# EAGLE design GridThumbs (EAGLE 9.1.1)
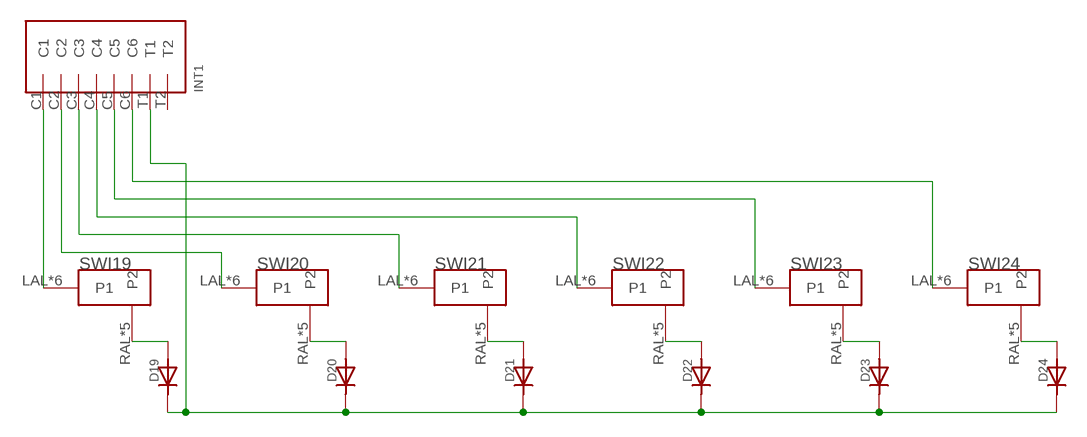
[diagram p0: schematic, sheet 1]

## Parts
D19  DIODE  [DIODE_COMBO]
D20  DIODE  [DIODE_COMBO]
D21  DIODE  [DIODE_COMBO]
D22  DIODE  [DIODE_COMBO]
D23  DIODE  [DIODE_COMBO]
D24  DIODE  [DIODE_COMBO]
INT1  INTRCNNT4X2  [INTRRIBBON]
SWI19  MX/ALPSDOUBLESIDED  [DOUBLED_MX/ALPS]
SWI20  MX/ALPSDOUBLESIDED  [DOUBLED_MX/ALPS]
SWI21  MX/ALPSDOUBLESIDED  [DOUBLED_MX/ALPS]
SWI22  MX/ALPSDOUBLESIDED  [DOUBLED_MX/ALPS]
SWI23  MX/ALPSDOUBLESIDED  [DOUBLED_MX/ALPS]
SWI24  MX/ALPSDOUBLESIDED  [DOUBLED_MX/ALPS]

## Nets
N$2: INT1.C2 SWI20.LAL(P1) SWI20.LAR(P1) SWI20.LCL(P1) SWI20.LCR(P1) SWI20.LLP(P1) SWI20.LRLP(P1)
N$3: INT1.C3 SWI21.LAL(P1) SWI21.LAR(P1) SWI21.LCL(P1) SWI21.LCR(P1) SWI21.LLP(P1) SWI21.LRLP(P1)
N$4: INT1.C4 SWI22.LAL(P1) SWI22.LAR(P1) SWI22.LCL(P1) SWI22.LCR(P1) SWI22.LLP(P1) SWI22.LRLP(P1)
N$5: INT1.C5 SWI23.LAL(P1) SWI23.LAR(P1) SWI23.LCL(P1) SWI23.LCR(P1) SWI23.LLP(P1) SWI23.LRLP(P1)
N$6: INT1.C6 SWI24.LAL(P1) SWI24.LAR(P1) SWI24.LCL(P1) SWI24.LCR(P1) SWI24.LLP(P1) SWI24.LRLP(P1)
N$7: D19.ANOSB(AN) D19.ANOST(AN) D19.ANOT(AN) SWI19.RAL(P2) SWI19.RAR(P2) SWI19.RCL(P2) SWI19.RCR(P2) SWI19.RLMID(P2)
N$8: D20.ANOSB(AN) D20.ANOST(AN) D20.ANOT(AN) SWI20.RAL(P2) SWI20.RAR(P2) SWI20.RCL(P2) SWI20.RCR(P2) SWI20.RLMID(P2)
N$9: D21.ANOSB(AN) D21.ANOST(AN) D21.ANOT(AN) SWI21.RAL(P2) SWI21.RAR(P2) SWI21.RCL(P2) SWI21.RCR(P2) SWI21.RLMID(P2)
N$10: D22.ANOSB(AN) D22.ANOST(AN) D22.ANOT(AN) SWI22.RAL(P2) SWI22.RAR(P2) SWI22.RCL(P2) SWI22.RCR(P2) SWI22.RLMID(P2)
N$11: D23.ANOSB(AN) D23.ANOST(AN) D23.ANOT(AN) SWI23.RAL(P2) SWI23.RAR(P2) SWI23.RCL(P2) SWI23.RCR(P2) SWI23.RLMID(P2)
N$12: D24.ANOSB(AN) D24.ANOST(AN) D24.ANOT(AN) SWI24.RAL(P2) SWI24.RAR(P2) SWI24.RCL(P2) SWI24.RCR(P2) SWI24.RLMID(P2)
N$19: D19.CATSB(CAT) D19.CATST(CAT) D19.CATT(CAT) D20.CATSB(CAT) D20.CATST(CAT) D20.CATT(CAT) D21.CATSB(CAT) D21.CATST(CAT) D21.CATT(CAT) D22.CATSB(CAT) D22.CATST(CAT) D22.CATT(CAT) D23.CATSB(CAT) D23.CATST(CAT) D23.CATT(CAT) D24.CATSB(CAT) D24.CATST(CAT) D24.CATT(CAT) INT1.T1
N$21: INT1.C1 SWI19.LAL(P1) SWI19.LAR(P1) SWI19.LCL(P1) SWI19.LCR(P1) SWI19.LLP(P1) SWI19.LRLP(P1)
Unconnected: INT1.T2

## Library data of the parts
D19-D24 = Keys:DIODE
INT1 = Keys:INTRCNNT
SWI19-SWI24 = Keys:MX/ALPS

## Board
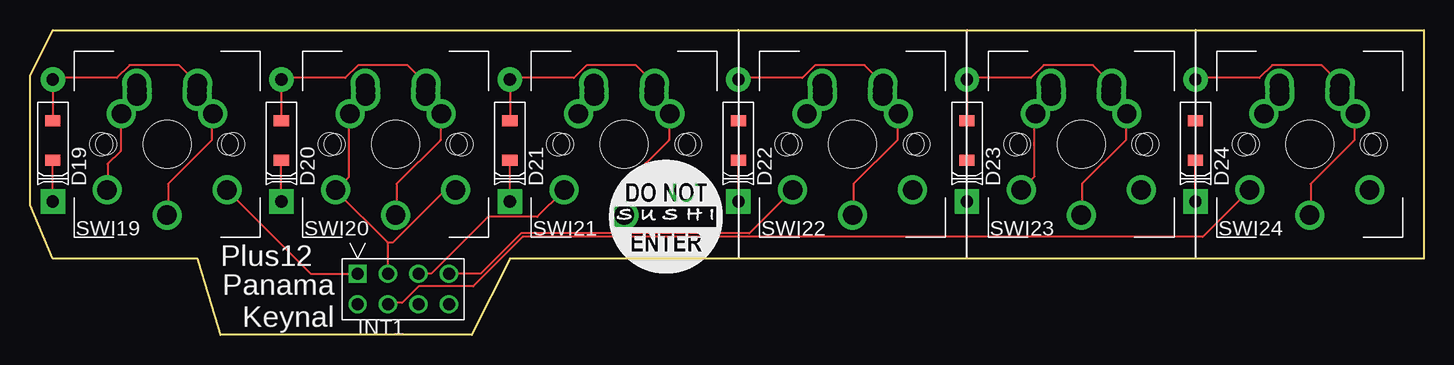
[diagram p1: board, top side]
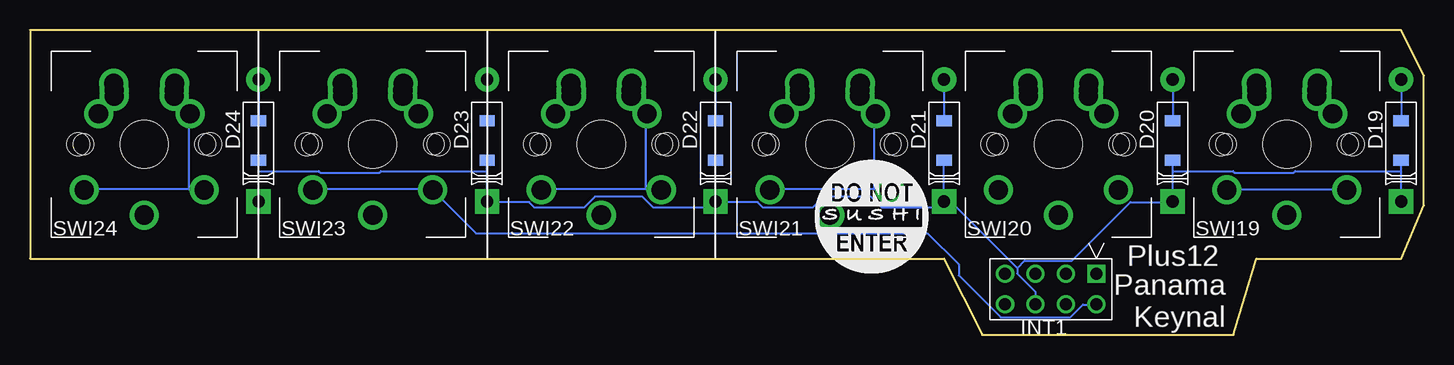
[diagram p2: board, bottom side, seen from below]

Size 116.2 x 25.4 mm. Coordinates in mm from the lower left corner, seen from the top.
Outline: 1.9,6.35 0,10.79 0,21.59 1.9,25.4 116.2,25.4 116.2,6.35 40.01,6.35 36.83,0 15.88,0 13.97,6.35 1.9,6.35
Copper layers (1*16): Top 0.035mm / dielectric 1.5mm / Bottom 0.035mm
Design rules "Sierra": minimum track width 6mil, minimum drill 6mil, track to track 6mil, track to pad 6mil, pad to pad 6mil, via to via 6mil, smd to smd 6mil, copper to edge 10mil, drill to drill 10mil, minimum pad ring 10mil, minimum via ring 8mil, stop-mask expansion 4mil, vias tented up to drill 0mil, thermal gap 10mil

### Footprints (pad centres in the part's own frame; a part is rotated, then mirrored left to right if it is on the bottom)
DIODE_COMBO = smd 0.914 x 1.27 bottom: ANOSB 1.651,0; CATSB -1.651,0 | smd 0.914 x 1.27: ANOST 1.651,0; CATST -1.651,0 | drill 1.016 pad 2.032: ANOT 5.08,0 | drill 1.016 pad 2.032 square: CATT -5.08,0
INTRRIBBON = drill 1.016 square: C1 0,0 | drill 1.016: C2 2.54,0; C3 5.08,0; C4 7.62,0; C5 0,-2.54; C6 2.54,-2.54; T1 5.08,-2.54; T2 7.62,-2.54
DOUBLED_MX/ALPS = drill 1.613: LAL -2.5,4; LAR -2.5,4.5; LCL -3.81,2.54; LCR -2.54,5.08; LLP -5,-3.8; LRLP 5,-3.8; RAL 2.5,4; RAR 2.5,4.5; RCL 3.81,2.54; RCR 2.54,5.08; RLMID 0,-5.9 | hole 3.988: 0,0 | hole 1.702: -5.08,0; 5.08,0 | hole 1.9: -5.5,0; 5.5,0

### Placement (x,y rotation side)
D19  1.9,16.19 90 top
D20  20.95,16.19 90 top
D21  40.01,16.19 90 top
D22  59.05,16.19 90 top
D23  78.1,16.19 90 top
D24  97.16,16.19 90 top
INT1  27.3,5.08 0 top
SWI19  11.43,15.87 0 top
SWI20  30.48,15.87 0 top
SWI21  49.53,15.87 0 top
SWI22  68.58,15.87 0 top
SWI23  87.63,15.87 0 top
SWI24  106.68,15.87 0 top
U$1  [3_8INCH_BOT]  41.27,5.08 0 top
U$2  [3_8INCH_TOP]  48.26,5.08 0 top

### Tracks (layer width: path | path; a pad name or v marks a point on that pad's centre or on a via)
N$2
  Top 0.152: SWI20.LCR 27.96,20.95 27.96,20.5 SWI20.LAL 27.96,19.89 SWI20.LAR 27.96,19.74 26.75,18.52 SWI20.LCL 26.59,18.36 26.59,13.18 25.53,12.12 SWI20.LLP 25.53,11.96 29.79,7.7 | 29.79,7.7 29.79,5.11 INT1.C2 | 29.79,7.7 30.25,7.7 34.52,11.96 35.43,11.96 SWI20.LRLP
N$3
  Top 0.152: SWI21.LCL 45.8,18.52 47.02,19.74 SWI21.LAR 47.02,19.89 SWI21.LAL 47.02,20.5 47.02,20.95 SWI21.LCR | INT1.C3 32.38,5.11 33.45,5.11 38.18,9.83 42.29,9.83 44.42,11.96 SWI21.LLP
  Bottom 0.152: 45.8,12.12 44.58,12.12 SWI21.LLP | 45.8,12.12 54.48,12.12 SWI21.LRLP | 45.8,12.12 45.8,18.36 SWI21.LCL
N$4
  Top 0.152: SWI22.LCL 64.85,18.52 66.06,19.74 SWI22.LAR 66.06,19.89 SWI22.LAL 66.06,20.5 66.06,20.95 SWI22.LCR | INT1.C4 34.98,5.11 37.57,5.11 40.92,8.46 59.97,8.46 63.48,11.96 SWI22.LLP
  Bottom 0.152: 64.85,12.12 63.63,12.12 SWI22.LLP | 64.85,12.12 73.53,12.12 SWI22.LRLP | 64.85,12.12 64.85,18.36 SWI22.LCL
N$5
  Top 0.152: SWI23.LCR 85.12,20.95 85.12,20.5 SWI23.LAR 85.27,20.34 85.27,19.89 SWI23.LAL 85.12,19.74 83.9,18.52 SWI23.LCL 83.74,18.36 83.74,13.18 82.68,12.12 SWI23.LLP
  Bottom 0.152: INT1.C5 27.36,2.51 28.42,2.51 29.49,1.45 35.28,1.45 38.79,4.95 38.79,5.87 41.38,8.46 79.02,8.46 82.53,11.96 SWI23.LLP 82.68,12.12 92.58,12.12 SWI23.LRLP
N$6
  Top 0.152: SWI24.LCL 102.95,18.52 104.16,19.74 SWI24.LAR 104.16,19.89 SWI24.LAL 104.16,20.5 104.16,20.95 SWI24.LCR | INT1.C6 29.95,2.67 31.01,2.67 32.38,4.04 36.96,4.04 41.07,8.15 97.76,8.15 101.57,11.96 SWI24.LLP
  Bottom 0.152: 102.95,12.12 101.73,12.12 SWI24.LLP | 102.95,12.12 111.63,12.12 SWI24.LRLP | 102.95,12.12 102.95,18.36 SWI24.LCL
N$7
  Top 0.152: SWI19.RLMID 11.51,9.98 11.51,12.57 15.16,16.23 15.16,18.36 SWI19.RCL 15.16,18.52 13.95,19.74 SWI19.RAR | D19.ANOST 1.9,17.91 1.9,21.26 D19.ANOT 1.9,21.41 7.24,21.41 8.31,22.48 12.42,22.48 13.95,20.95 | 13.95,20.95 SWI19.RAL 13.95,20.34 SWI19.RAR | 13.95,20.95 SWI19.RCR | 13.95,20.95 SWI19.RAR
  Bottom 0.152: D19.ANOST 1.9,17.91 1.9,21.26 D19.ANOT
N$8
  Top 0.152: SWI20.RLMID 30.56,9.98 30.56,12.57 34.21,16.23 34.21,18.36 SWI20.RCL 34.21,18.52 32.99,19.74 SWI20.RAR | D20.ANOST 20.95,17.91 20.95,21.26 D20.ANOT 20.95,21.41 26.29,21.41 27.36,22.48 31.47,22.48 32.99,20.95 | 32.99,20.95 SWI20.RAL 32.99,20.34 SWI20.RAR | 32.99,20.95 SWI20.RCR | 32.99,20.95 SWI20.RAR
  Bottom 0.152: D20.ANOST 20.95,17.91 20.95,21.26 D20.ANOT
N$9
  Top 0.152: SWI21.RLMID 49.61,9.98 49.61,12.57 53.26,16.23 53.26,18.36 SWI21.RCL 53.26,18.52 52.04,19.74 SWI21.RAR | D21.ANOST 40.01,17.91 40.01,21.26 D21.ANOT 40.01,21.41 45.34,21.41 46.41,22.48 50.52,22.48 52.04,20.95 | 52.04,20.95 SWI21.RAL 52.04,20.34 SWI21.RAR | 52.04,20.95 SWI21.RCR | 52.04,20.95 SWI21.RAR
  Bottom 0.152: D21.ANOST 40.01,17.91 40.01,21.26 D21.ANOT
N$10
  Top 0.152: SWI22.RLMID 68.66,9.98 68.66,12.57 72.31,16.23 72.31,18.36 SWI22.RCL 72.31,18.52 71.09,19.74 SWI22.RAR | D22.ANOST 59.05,17.91 59.05,21.26 D22.ANOT 59.05,21.41 64.39,21.41 65.46,22.48 69.57,22.48 71.09,20.95 | 71.09,20.95 SWI22.RAL 71.09,20.34 SWI22.RAR | 71.09,20.95 SWI22.RCR | 71.09,20.95 SWI22.RAR
  Bottom 0.152: D22.ANOST 59.05,17.91 59.05,21.26 D22.ANOT
N$11
  Top 0.152: SWI23.RLMID 87.71,9.98 87.71,12.57 91.36,16.23 91.36,18.36 SWI23.RCL 91.36,18.52 90.15,19.74 SWI23.RAR | D23.ANOST 78.1,17.91 78.1,21.26 D23.ANOT 78.1,21.41 83.44,21.41 84.51,22.48 88.62,22.48 90.15,20.95 | 90.15,20.95 SWI23.RAL 90.15,20.34 SWI23.RAR | 90.15,20.95 SWI23.RCR | 90.15,20.95 SWI23.RAR
  Bottom 0.152: D23.ANOST 78.1,17.91 78.1,21.26 D23.ANOT
N$12
  Top 0.152: SWI24.RLMID 106.76,9.98 106.76,12.57 110.41,16.23 110.41,18.36 SWI24.RCL 110.41,18.52 109.19,19.74 SWI24.RAR | D24.ANOST 97.16,17.91 97.16,21.26 D24.ANOT 97.16,21.41 102.49,21.41 103.56,22.48 107.67,22.48 109.19,20.95 | 109.19,20.95 SWI24.RAL 109.19,20.34 SWI24.RAR | 109.19,20.95 SWI24.RCR | 109.19,20.95 SWI24.RAR
  Bottom 0.152: D24.ANOST 97.16,17.91 97.16,21.26 D24.ANOT
N$19
  Top 0.152: D23.CATST 78.1,14.4 78.1,11.2 D23.CATT | D24.CATST 97.16,14.4 97.16,11.2 D24.CATT | D19.CATST 1.9,14.4 1.9,11.2 D19.CATT | D20.CATST 20.95,14.4 20.95,11.2 D20.CATT | D22.CATST 59.05,14.4 59.05,11.2 D22.CATT | D21.CATST 40.01,14.4 40.01,11.2 D21.CATT
  Bottom 0.152: 78.1,13.64 78.1,11.2 D23.CATT 78.1,11.05 74.6,11.05 74.14,10.59 70.03,10.59 69.11,11.51 65.15,11.51 64.24,10.59 59.51,10.59 59.05,11.05 | 78.1,13.64 78.1,14.4 D23.CATST | 97.16,13.64 97.16,11.2 D24.CATT | 97.16,13.64 97.16,14.4 D24.CATST | 78.1,13.64 86.94,13.64 87.1,13.49 91.97,13.49 92.13,13.64 97.16,13.64 | 1.9,13.64 1.9,11.2 D19.CATT | 1.9,13.64 1.9,14.4 D19.CATST | 20.95,13.64 20.95,11.2 D20.CATT 20.95,11.05 24.46,11.05 29.34,6.17 33.3,6.17 33.91,5.56 | 20.95,13.64 20.95,14.4 D20.CATST | 1.9,13.64 10.74,13.64 10.9,13.49 15.77,13.49 15.93,13.64 20.95,13.64 | D22.CATST 59.05,14.4 59.05,11.2 D22.CATT | D21.CATST 40.01,14.4 40.01,11.2 D21.CATT | 33.91,5.56 33.91,5.11 32.38,3.58 32.38,2.67 INT1.T1 | 33.91,5.56 39.39,11.05 40.01,11.05 | 40.01,11.05 D21.CATT | 59.05,11.05 55.55,11.05 55.09,10.59 50.98,10.59 50.06,11.51 46.1,11.51 45.19,10.59 40.46,10.59 40.01,11.05 | 59.05,11.05 D22.CATT | 40.01,11.05 D21.CATT | 59.05,11.05 D22.CATT
N$21
  Top 0.152: SWI19.LAL 9.07,19.89 9.07,20.34 SWI19.LAR | SWI19.LCR 8.91,20.95 8.91,20.5 SWI19.LAL | SWI19.LLP 6.48,12.12 6.48,14.25 7.54,15.32 7.54,18.36 SWI19.LCL 7.7,18.52 8.91,19.74 SWI19.LAL | INT1.C1 27.2,5.11 23.39,5.11 16.54,11.96 SWI19.LRLP
  Bottom 0.152: SWI19.LLP 6.48,12.12 16.38,12.12 SWI19.LRLP

### Text on the board
tPlace: Plus12 | Panama / Keynal
bPlace: Plus12 | Panama / Keynal